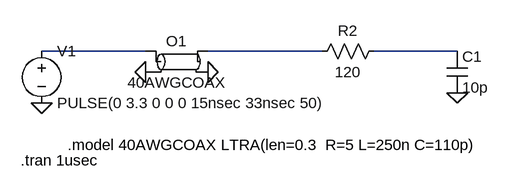
[diagram p0: schematic 40AWG MICROCOAX.asc]
40AWG MICROCOAX.asc, the LTspice schematic file:
Version 4
SHEET 1 880 680
WIRE 128 96 -32 96
WIRE 400 96 224 96
WIRE 608 96 480 96
FLAG 128 128 0
FLAG 224 128 0
FLAG -32 176 0
FLAG 608 160 0
SYMBOL ltline 176 112 R0
SYMATTR InstName O1
SYMATTR Value 40AWGCOAX
SYMBOL voltage -32 80 R0
WINDOW 123 0 0 Left 2
WINDOW 39 24 124 Left 2
SYMATTR InstName V1
SYMATTR Value PULSE(0 3.3 0 0 0 15nsec 33nsec 50)
SYMBOL res 496 80 R90
WINDOW 0 0 56 VBottom 2
WINDOW 3 32 56 VTop 2
SYMATTR InstName R2
SYMATTR Value 120
SYMBOL cap 592 96 R0
SYMATTR InstName C1
SYMATTR Value 10p
TEXT 8 240 Left 2 !.model 40AWGCOAX LTRA(len=0.3  R=5 L=250n C=110p)
TEXT -64 264 Left 2 !.tran 1usec

The netlist it stands for:
* 40AWG MICROCOAX.asc
O1 N001 0 N002 0 40AWGCOAX
V1 N001 0 PULSE(0 3.3 0 0 0 15nsec 33nsec 50)
R2 N003 N002 120
C1 N003 0 10p
.model 40AWGCOAX LTRA(len=0.3  R=5 L=250n C=110p)
.tran 1usec
.backanno
.end